# EAGLE schematic Satellite (EAGLE 5.11)
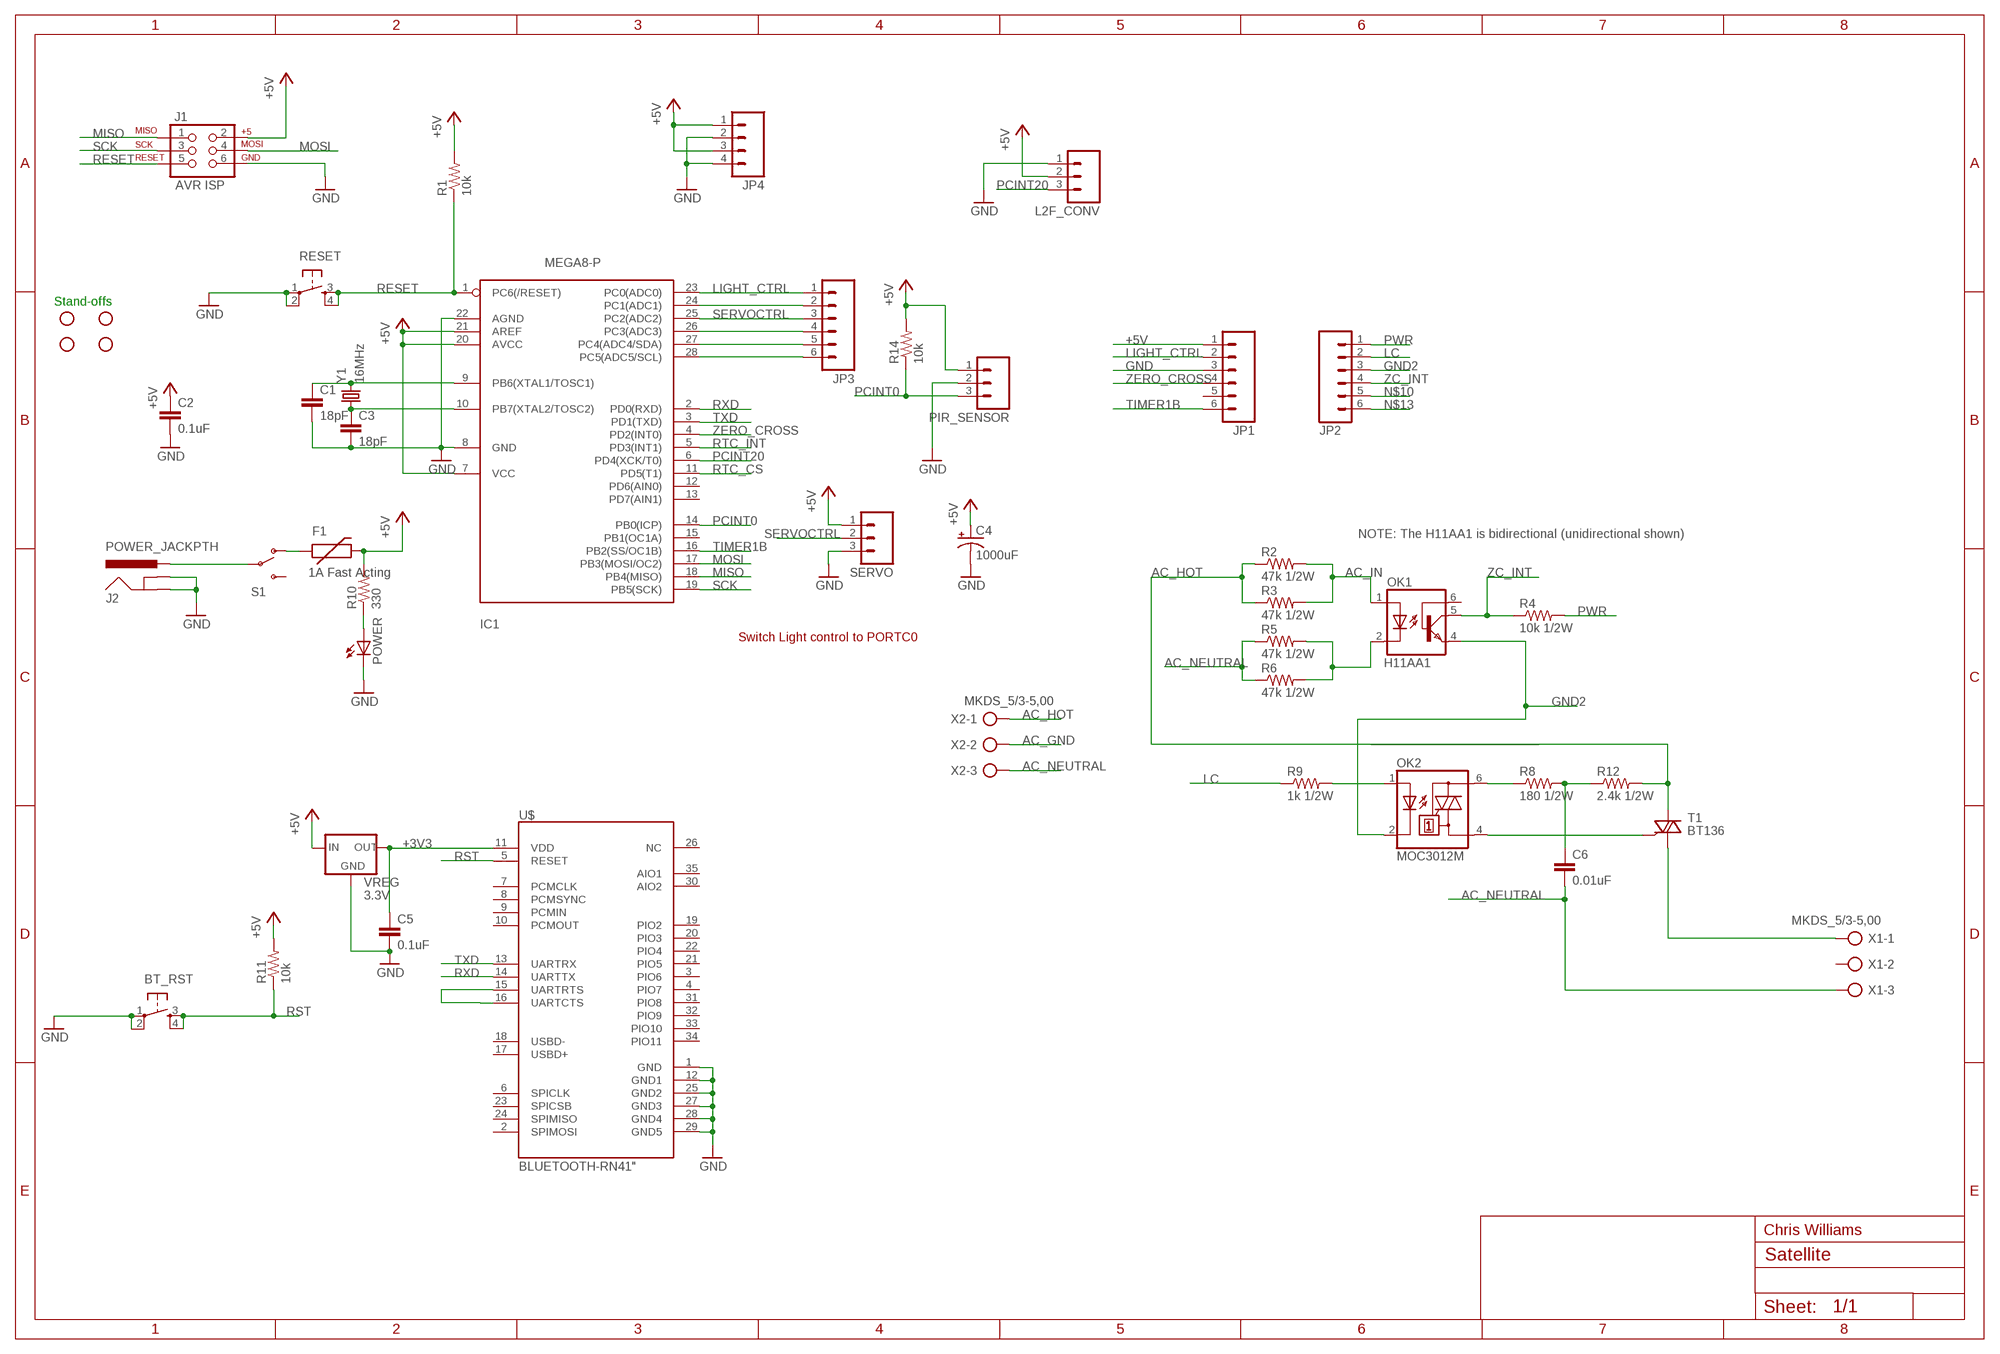
[diagram p0: schematic, sheet 1]

## Parts
BT_RST  TAC_SWITCHPTH  [TACTILE-PTH]
C1  18pF  CAPPTH2  [CAP-PTH-SMALL2]
C2  0.1uF  CAPPTH2  [CAP-PTH-SMALL2]
C3  18pF  CAPPTH2  [CAP-PTH-SMALL2]
C4  1000uF  CPOL-USE7.5-16  [E7,5-16]
C5  0.1uF  CAPPTH2  [CAP-PTH-SMALL2]
C6  0.01uF  C5/5  [C5B5]
F1  1A Fast Acting  PTCPTH  [PTC]
IC1  MEGA8-P  [DIL28-3]
J1  AVR ISP  AVR_SPI_PRG_6PTH  [2X3]
J2  POWER_JACKPTH  [POWER_JACK_PTH]
JP1  M06SIP  [1X06]
JP2  M06SIP  [1X06]
JP3  M06SIP  [1X06]
JP4  M04PTH  [1X04]
JP5  STAND-OFF  [STAND-OFF]
JP6  STAND-OFF  [STAND-OFF]
JP7  STAND-OFF  [STAND-OFF]
JP8  STAND-OFF  [STAND-OFF]
L2F_CONV  M03PTH  [1X03]
OK1  4N25M  [DIL06]
OK2  MOC3012M  [DIL06]
PIR_SENSOR  M03PTH  [1X03]
POWER  LED3MM  [LED3MM]
R1  10k  RESISTORPTH-1/4W  [AXIAL-0.4]
R2  47k 1/2W  RESISTORPTH-1/2W  [AXIAL-0.5]
R3  47k 1/2W  RESISTORPTH-1/2W  [AXIAL-0.5]
R4  10k 1/2W  RESISTORPTH-1/2W  [AXIAL-0.5]
R5  47k 1/2W  RESISTORPTH-1/2W  [AXIAL-0.5]
R6  47k 1/2W  RESISTORPTH-1/2W  [AXIAL-0.5]
R8  180 1/2W  RESISTORPTH-1/2W  [AXIAL-0.5]
R9  1k 1/2W  RESISTORPTH-1/2W  [AXIAL-0.5]
R10  330  RESISTORPTH-1/4W  [AXIAL-0.4]
R11  10k  RESISTORPTH-1/4W  [AXIAL-0.4]
R12  2.4k 1/2W  RESISTORPTH-1/2W  [AXIAL-0.5]
R14  10k  RESISTORPTH-1/4W  [AXIAL-0.4]
RESET  TAC_SWITCHPTH  [TACTILE-PTH]
S1  SWITCH-SPSTKIT  [SWITCH-SPDT_KIT]
SERVO  M03PTH  [1X03]
T1  BT136  [TO220AB]
U$  BLUETOOTH-RN41"  [RN41]
VREG  3.3V  V_REG_78XXSIDE  [78XXL]
X1  MKDS_5/3-5,00  [MKDS_5/3-500]
X2  MKDS_5/3-5,00  [MKDS_5/3-500]
Y1  16MHz  CRYSTALHC49US  [HC49US]

## Nets
+3V3: C5.1 U$.11(VDD) VREG.OUT
+5V: C2.1 C4.+ F1.P$2 IC1.7(VCC) IC1.20(AVCC) IC1.21(AREF) J1.2 JP1.1 JP4.1 JP4.3 L2F_CONV.2 PIR_SENSOR.1 R1.P$2 R10.P$2 R11.P$2 R14.P$2 SERVO.1 VREG.IN
AC1 [AC_HOT]: OK2.6(A2) R8.P$1
AC2 [AC_HOT]: C6.1 R8.P$2 R12.P$1
AC_GND: X2.2
AC_HOT [AC_HOT]: R2.P$1 R3.P$1 R12.P$2 T1.2(A2) X2.1
AC_IN [AC_HOT]: OK1.1(A) R2.P$2 R3.P$2
AC_NEUTRAL [AC_HOT]: C6.2 R5.P$1 R6.P$1 X1.3 X2.3
AC_OUT [AC_HOT]: T1.1(A1) X1.1
GND: BT_RST.1 BT_RST.2 C1.2 C2.2 C3.2 C4.- C5.2 IC1.8(GND) IC1.22(AGND) J1.6 J2.GND J2.GNDBREAK JP1.3 JP4.2 JP4.4 L2F_CONV.1 PIR_SENSOR.2 POWER.K(C) RESET.1 RESET.2 SERVO.3 U$.1(GND) U$.12(GND1) U$.25(GND2) U$.27(GND3) U$.28(GND4) U$.29(GND5) VREG.GND
GND2: JP2.3 OK1.4(EMI) OK2.2(C)
LC: JP2.2 R9.P$1
LIGHT_CTRL: IC1.23(PC0(ADC0)) JP1.2 JP3.1
MISO: IC1.18(PB4(MISO)) J1.1
MOSI: IC1.17(PB3(MOSI/OC2)) J1.4
N$1: IC1.24(PC1(ADC1)) JP3.2
N$2: J2.PWR S1.2(P)
N$5: C3.1 IC1.10(PB7(XTAL2/TOSC2)) Y1.1
N$6: C1.1 IC1.9(PB6(XTAL1/TOSC1)) Y1.2
N$8: OK2.4(A1) T1.3(G)
N$10: JP2.5
N$13: JP2.6
N$15: IC1.26(PC3(ADC3)) JP3.4
N$18: F1.P$1 S1.1(O)
N$19: POWER.A R10.P$1
N$21: IC1.27(PC4(ADC4/SDA)) JP3.5
N$22: IC1.28(PC5(ADC5/SCL)) JP3.6
N$29: OK2.1(A) R9.P$2
NEUT_IN [AC_HOT]: OK1.2(C) R5.P$2 R6.P$2
PCINT0: IC1.14(PB0(ICP)) PIR_SENSOR.3 R14.P$1
PCINT20: IC1.6(PD4(XCK/T0)) L2F_CONV.3
PWR: JP2.1 R4.P$2
RESET: IC1.1(PC6(/RESET)) J1.5 R1.P$1 RESET.3 RESET.4
RST: BT_RST.3 BT_RST.4 R11.P$1 U$.5(RESET)
RTC_CS: IC1.11(PD5(T1))
RTC_INT: IC1.5(PD3(INT1))
RTS: U$.15(UARTRTS) U$.16(UARTCTS)
RXD: IC1.2(PD0(RXD)) U$.14(UARTTX)
SCK: IC1.19(PB5(SCK)) J1.3
SERVOCTRL: IC1.25(PC2(ADC2)) JP3.3 SERVO.2
TIMER1B: IC1.16(PB2(SS/OC1B)) JP1.6
TXD: IC1.3(PD1(TXD)) U$.13(UARTRX)
ZC_INT: JP2.4 OK1.5(COL) R4.P$1
ZERO_CROSS: IC1.4(PD2(INT0)) JP1.4
Unconnected: IC1.12(PD6(AIN0)) IC1.13(PD7(AIN1)) IC1.15(PB1(OC1A)) JP1.5 OK1.6(BAS) S1.3(S) U$.2(SPIMOSI) U$.3(PIO6) U$.4(PIO7) U$.6(SPICLK) U$.7(PCMCLK) U$.8(PCMSYNC) U$.9(PCMIN) U$.10(PCMOUT) U$.17(USBD+) U$.18(USBD-) U$.19(PIO2) U$.20(PIO3) U$.21(PIO5) U$.22(PIO4) U$.23(SPICSB) U$.24(SPIMISO) U$.26(NC) U$.30(AIO2) U$.31(PIO8) U$.32(PIO9) U$.33(PIO10) U$.34(PIO11) U$.35(AIO1) X1.2

## Notes on the sheet
- Stand-offs
- NOTE: The H11AA1 is bidirectional (unidirectional shown)
- Switch Light control to PORTC0
- H11AA1
- Chris Williams

## Library data of the parts
BT_RST RESET = SparkFun:TAC_SWITCH: Momentary Switch Button commonly used for reset or general input. Spark Fun Electronics SKU : COM-00097
C1-C3 C5 = SparkFun:CAP: Capacitor Standard 0603 ceramic capacitor, and 0.1" leaded capacitor.
C4 = rcl:CPOL-US: POLARIZED CAPACITOR, American symbol
C6 = capacitor-wima:C: CAPACITOR naming: grid - package width
F1 = SparkFun:PTC: Resettable Fuse PTC Resettable Fuse. Spark Fun Electronics SKU : COM-08357
IC1 = atmel:MEGA8-P: MICROCONTROLLER 8 Kbytes FLASH, 1 kbytes SRAM, 512 bytes EEPROM, USART, 4-channel 10 bit ADC, 2-channel 8 bit ADC Pin compatible with Atmega48, ATMega88, ATMega168 Source: avr.lbr
J1 = SparkFun:AVR_SPI_PRG_6: AVR ISP 6 Pin This is the reduced ISP connector for AVR programming. Common on Arduino. This footprint will take up less PCB space and can be used with a 10-pin to 6-pin adapter such as SKU: BOB-08508
J2 = SparkFun:POWER_JACK: Power Jack This is the standard 5.5mm barrel jack for power. The PTH is the most common, proven, reliable, footprint. All others are experimental. The Slot footprint only works if the mill layer is transmitted to the PCB fab house so be warned. Spark Fun Electronics SKU : PRT-00119. Mating wall wart : TOL-00298 (and others)
JP1-JP3 = SparkFun:M06: Header 6 Standard 6-pin 0.1" header. Use with straight break away headers (SKU : PRT-00116), right angle break away headers (PRT-00553), swiss pins (PRT-00743), machine pins (PRT-00117), and female headers (PRT-00115). Molex polarized connector foot print use with SKU : PRT-08094 with associated crimp pins and housings. NOTES ON THE VARIANTS LOCK and LOCK_LONGPADS... This footprint was designed to help hold the alignment of a through-hole component (i.e. 6-pin header) while soldering it into place. You may notice that each hole has been shifted either up or down by 0.005 of an inch from it's more standard position (which is a perfectly straight line). This slight alteration caused the pins (the squares in the middle) to touch the edges of the holes. Because they are alternating, it causes a "brace" to hold the component in place. 0.005 has proven to be the perfect amount of "off-center" position when using our standard breakaway headers. Although looks a little odd when you look at the bare footprint, once you have a header in there, the alteration is very hard to notice. Also, if you push a header all the way into place, it is covered up entirely on the bottom side. This idea of altering the position of holes to aid alignment will be further integrated into the Sparkfun Library for other footprints. It can help hold any component with 3 or more connection pins.
JP4 = SparkFun:M04: Header 4 Standard 4-pin 0.1" header. Use with straight break away headers (SKU : PRT-00116), right angle break away headers (PRT-00553), swiss pins (PRT-00743), machine pins (PRT-00117), and female headers (PRT-00115). Molex polarized connector foot print use with SKU : PRT-08231 with associated crimp pins and housings. 1MM SMD Version SKU: PRT-10208
JP5-JP8 = SparkFun:STAND-OFF: Stand Off This is the mechanical footprint for a #4 phillips button head screw. Use the keepout ring to avoid running the screw head into surrounding components. SKU : PRT-00447
L2F_CONV PIR_SENSOR SERVO = SparkFun:M03: Header 3 Standard 3-pin 0.1" header. Use with straight break away headers (SKU : PRT-00116), right angle break away headers (PRT-00553), swiss pins (PRT-00743), machine pins (PRT-00117), and female headers (PRT-00115). Molex polarized connector foot print use with SKU : PRT-08232 with associated crimp pins and housings.
OK1 = optocoupler:4N*?M: General Purpose 6-Pin Phototransistor Optocouplers Source: http://www.fairchildsemi.com/ds/4N/4N35-M.pdf; MPN: 4N25-M; OC_FARNELL: 1021349; OC_NEWARK: 98K9084
OK2 = optocoupler:MOC30*M: RANDOM-PHASE OPTOISOLATORS TRIAC DRIVER OUTPUT Source: http://www.fairchildsemi.com MOC3020-M.pdf; MF: FAIRCHILD SEMICONDUCTOR; MPN: MOC3012-M; OC_FARNELL: 1021364; OC_NEWARK: 72K8894
POWER = led:LED: LED OSRAM: - CHIPLED LG R971, LG N971, LY N971, LG Q971, LY Q971, LO R971, LY R971 LH N974, LH R974 LS Q976, LO Q976, LY Q976 LO Q996 - Hyper CHIPLED LW Q18S LB Q993, LB Q99A, LB R99A - SideLED LS A670, LO A670, LY A670, LG A670, LP A670 LB A673, LV A673, LT A673, LW A673 LH A674 LY A675 LS A676, LA A676, LO A676, LY A676, LW A676 LS A679, LY A679, LG A679 - Hyper Micro SIDELED® LS Y876, LA Y876, LO Y876, LY Y876 LT Y87S - SmartLED LW L88C, LW L88S LB L89C, LB L89S, LG L890 LS L89K, LO L89K, LY L89K LS L896, LA L896, LO L896, LY L896 - TOPLED LS T670, LO T670, LY T670, LG T670, LP T670 LSG T670, LSP T670, LSY T670, LOP T670, LYG T670 LG T671, LOG T671, LSG T671 LB T673, LV T673, LT T673, LW T673 LH T674 LS T676, LA T676, LO T676, LY T676, LB T676, LH T676, LSB T676, LW T676 LB T67C, LV T67C, LT T67C, LS T67K, LO T67K, LY T67K, LW E67C LS E67B, LA E67B, LO E67B, LY E67B, LB E67C, LV E67C, LT E67C LW T67C LS T679, LY T679, LG T679 LS T770, LO T770, LY T770, LG T770, LP T770 LB T773, LV T773, LT T773, LW T773 LH T774 LS E675, LA E675, LY E675, LS T675 LS T776, LA T776, LO T776, LY T776, LB T776 LHGB T686 LT T68C, LB T68C - Hyper Mini TOPLED® LB M676 - Mini TOPLED Santana® LG M470 LS M47K, LO M47K, LY M47K Source: http://www.osram.convergy.de LUXEON: - LUMILED® LXK2-PW12-R00, LXK2-PW12-S00, LXK2-PW14-U00, LXK2-PW14-V00 LXK2-PM12-R00, LXK2-PM12-S00, LXK2-PM14-U00 LXK2-PE12-Q00, LXK2-PE12-R00, LXK2-PE12-S00, LXK2-PE14-T00, LXK2-PE14-U00 LXK2-PB12-K00, LXK2-PB12-L00, LXK2-PB12-M00, LXK2-PB14-N00, LXK2-PB14-P00, LXK2-PB14-Q00 LXK2-PR12-L00, LXK2-PR12-M00, LXK2-PR14-Q00, LXK2-PR14-R00 LXK2-PD12-Q00, LXK2-PD12-R00, LXK2-PD12-S00 LXK2-PH12-R00, LXK2-PH12-S00 LXK2-PL12-P00, LXK2-PL12-Q00, LXK2-PL12-R00 Source: www.luxeon.com KINGBRIGHT: KA-3528ASYC Source: www.kingbright.com
R1-R6 R8-R12 R14 = SparkFun:RESISTOR: Resistor Basic schematic elements and footprints for 0603, 1206, and PTH resistors.
S1 = SparkFun:SWITCH-SPST: SPST Switch Simple slide switch. Spark Fun Electronics SKU : COM-00102
T1 = triac:BT136: Triac BT136 series E sensitive gate Source: http://www.nxp.com/acrobat_download/datasheets/BT136_SERIES_E_2.pdf
U$ = SparkFun:BLUETOOTH-RN41
VREG = SparkFun:V_REG_78XX: Voltage Regulator Standard 7805 5V regulator. IGO (Input Ground Output). Spark Fun Electronics SKU : COM-00107
X1 X2 = con-phoenix-mkds_5:MKDS_5/3-: MKDS 5/3-6,35 Source: PHOENIX CONTACT
Y1 = SparkFun:CRYSTAL: Crystals Various standard crystals. Proven footprints. Spark Fun Electronics SKU : COM-00534

## Net classes
1 AC_HOT: width 0.813 mm, clearance 0.381 mm